# Altium schematic sheet Schematic.SchDoc
size A
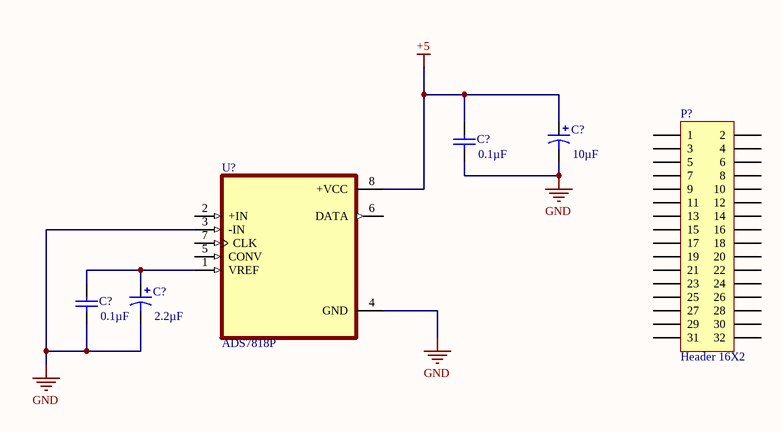
[diagram p0: Schematic.SchDoc]

## Parts
(Parts that share a designator on the sheet are numbered #1, #2 ... from top to bottom, then left to right.)
C?#1  value 10µF  [RB7.6-15]  (hidden comment: Cap Pol1)
C?#2  value 0.1µF  [RAD-0.3]  (hidden comment: Cap)
C?#3  value 2.2µF  [RB7.6-15]  (hidden comment: Cap Pol1)
C?#4  value 0.1µF  [RAD-0.3]  (hidden comment: Cap)
P?  Header 16X2  [HDR2X16]
U?  ADS7818P  [DIP794W45P254L959H508Q8]

## Nets
+5: C?#1.1 C?#2.2 U?.8(+VCC)
GND: C?#1.2 C?#2.1 C?#3.2 C?#4.1 U?.3(-IN) U?.4(GND)
NetC?#3_1: C?#3.1 C?#4.2 U?.1(VREF)

Not connected (* = marked no-connect by the designer): P? 1 2 3 4 5 6 7 8 9 10 11 12 13 14 15 16 17 18 19 20 21 22 23 24 25 26 27 28 29 30 31 32; U? 2(+IN) 5(CONV) 6(DATA) 7(CLK)

## Library data of the parts
C?#1 C?#3 = Cap Pol1: Polarized Capacitor (Radial); Published: 8-Jun-2000; LatestRevisionDate: 17-Jul-2002; LatestRevisionNote: Re-released for DXP Platform.; PackageReference: RB7.6-15; Publisher: Altium Limited; PackageDescription: Polarized Capacitor (Radial); 2 Leads
C?#2 C?#4 = Cap: Capacitor; Published: 8-Jun-2000; LatestRevisionDate: 17-Jul-2002; LatestRevisionNote: Re-released for DXP Platform.; PackageReference: RAD-0.3; Publisher: Altium Limited; PackageDescription: Radial Cap, Thru-Hole; 2 Leads; 0.3 in Pin Spacing
P? = Header 16X2: Header, 16-Pin, Dual row; LatestRevisionDate: 17-Jul-2002; LatestRevisionNote: Re-released for DXP Platform.; Publisher: Altium Limited
U? = ADS7818P: Package: None; Price: None; Value: *; MP: ADS7818P; Availability: Unavailable